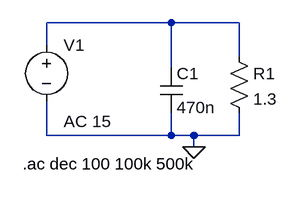
[diagram p0: schematic test-max-current.asc]
test-max-current.asc, the LTspice schematic file:
Version 4
SHEET 1 880 680
WIRE 112 96 -64 96
WIRE 208 96 112 96
WIRE -64 128 -64 96
WIRE 208 144 208 96
WIRE 112 160 112 96
WIRE -64 256 -64 208
WIRE 112 256 112 224
WIRE 112 256 -64 256
WIRE 144 256 112 256
WIRE 208 256 208 224
WIRE 208 256 144 256
WIRE 144 272 144 256
FLAG 144 272 0
SYMBOL res 192 128 R0
SYMATTR InstName R1
SYMATTR Value 1.3
SYMBOL cap 96 160 R0
SYMATTR InstName C1
SYMATTR Value 470n
SYMBOL voltage -64 112 R0
WINDOW 123 24 124 Left 2
WINDOW 39 0 0 Left 0
SYMATTR InstName V1
SYMATTR Value ""
SYMATTR Value2 AC 15
TEXT -98 296 Left 2 !.ac dec 100 100k 500k

The netlist it stands for:
* test-max-current.asc
R1 N001 0 1.3
C1 N001 0 470n
V1 N001 0 AC 15
.ac dec 100 100k 500k
.backanno
.end